# EAGLE design template_attiny_44_soic-14 (EAGLE 9.6.2)
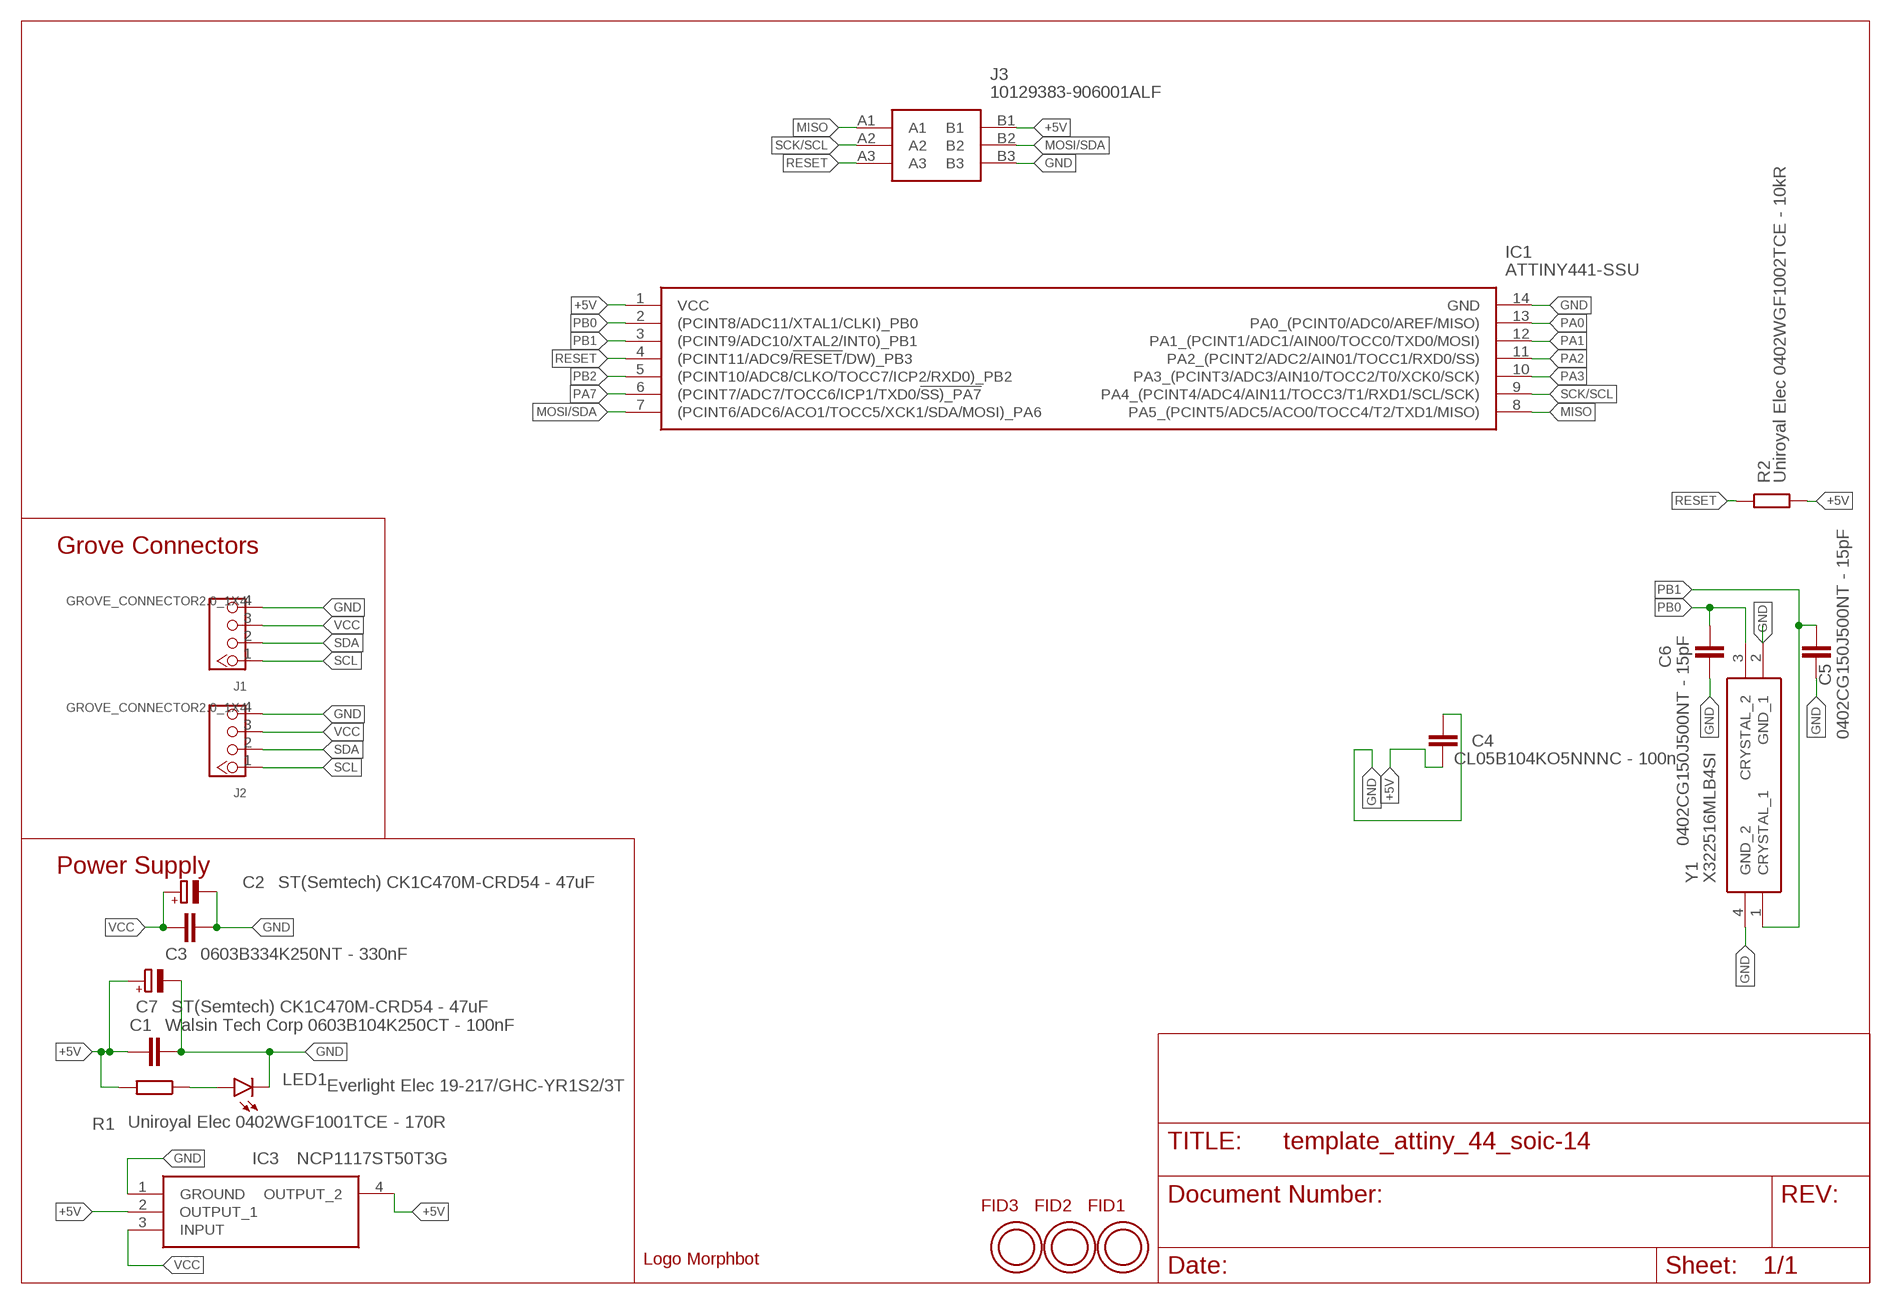
[diagram p0: schematic, sheet 1]

## Parts
C1  Walsin Tech Corp 0603B104K250CT - 100nF  C-EUC0603  [C0603]
C2  ST(Semtech) CK1C470M-CRD54 - 47uF  CPOL-EUC  [PANASONIC_C]
C3  0603B334K250NT - 330nF  C-EUC0603  [C0603]
C4  CL05B104KO5NNNC - 100n  C-EUC0402  [C0402]
C5  0402CG150J500NT - 15pF  C-EUC0402  [C0402]
C6  0402CG150J500NT - 15pF  C-EUC0402  [C0402]
C7  ST(Semtech) CK1C470M-CRD54 - 47uF  CPOL-EUC  [PANASONIC_C]
FID1  OPEN-PNP-FIDUCIAL  [OPEN-PNP-FIDUCIAL]
FID2  OPEN-PNP-FIDUCIAL  [OPEN-PNP-FIDUCIAL]
FID3  OPEN-PNP-FIDUCIAL  [OPEN-PNP-FIDUCIAL]
IC1  ATTINY441-SSU  [SOIC127P600X175-14N]
IC3  NCP1117ST50T3G  [SOT230P700X180-4N]
J1  GROVE_CONNECTOR2.0_1X4  [2.0_1X4_STRAIGHT]
J2  GROVE_CONNECTOR2.0_1X4  [2.0_1X4_STRAIGHT]
J3  10129383-906001ALF  [10129383906001ALF]
LED1  Everlight Elec 19-217/GHC-YR1S2/3T  LEDCHIPLED_0603  [CHIPLED_0603]
R1  Uniroyal Elec 0402WGF1001TCE - 170R  R-EU_R0402  [R0402]
R2  Uniroyal Elec 0402WGF1002TCE - 10kR  R-EU_R0402  [R0402]
U$1  LOGO_MORPHBOT5MM  [LOGO_MORPHBOT]
Y1  X322516MLB4SI  [X322516MLB4SI]

## Nets
+5V: C1.1 C4.1 C7.+ IC1.1(VCC) IC3.2(OUTPUT_1) IC3.4(OUTPUT_2) J3.B1 R1.2 R2.2
GND: C1.2 C2.- C3.1 C4.2 C5.1 C6.1 C7.- IC1.14(GND) IC3.1(GROUND) J1.4 J2.4 J3.B3 LED1.C Y1.2(GND_1) Y1.4(GND_2)
MISO: IC1.8(PA5_(PCINT5/ADC5/ACO0/TOCC4/T2/TXD1/MISO)) J3.A1
MOSI/SDA: IC1.7((PCINT6/ADC6/ACO1/TOCC5/XCK1/SDA/MOSI)_PA6) J3.B2
N$1: LED1.A R1.1
PA0: IC1.13(PA0_(PCINT0/ADC0/AREF/MISO))
PA1: IC1.12(PA1_(PCINT1/ADC1/AIN00/TOCC0/TXD0/MOSI))
PA2: IC1.11(PA2_(PCINT2/ADC2/AIN01/TOCC1/RXD0/SS))
PA3: IC1.10(PA3_(PCINT3/ADC3/AIN10/TOCC2/T0/XCK0/SCK))
PA7: IC1.6((PCINT7/ADC7/TOCC6/ICP1/TXD0/!SS)_PA7)
PB0: C6.2 IC1.2((PCINT8/ADC11/XTAL1/CLKI)_PB0) Y1.3(CRYSTAL_2)
PB1: C5.2 IC1.3((PCINT9/ADC10/XTAL2/INT0)_PB1) Y1.1(CRYSTAL_1)
PB2: IC1.5((PCINT10/ADC8/CLKO/TOCC7/ICP2/RXD0)_PB2)
RESET: IC1.4((PCINT11/ADC9/!RESET!/DW)_PB3) J3.A3 R2.1
SCK/SCL: IC1.9(PA4_(PCINT4/ADC4/AIN11/TOCC3/T1/RXD1/SCL/SCK)) J3.A2
SCL: J1.1 J2.1
SDA: J1.2 J2.2
VCC: C2.+ C3.2 IC3.3(INPUT) J1.3 J2.3

## Notes on the sheet
- Grove Connectors
- Power Supply

## Library data of the parts
C1 C3-C6 = rcl:C-EU: CAPACITOR, European symbol; SPICEPREFIX: C
C2 C7 = rcl:CPOL-EU: POLARIZED CAPACITOR, European symbol; SPICEPREFIX: C
FID1-FID3 = topo-eng:OPEN-PNP-FIDUCIAL
IC1 = samacsys:ATTINY441-SSU: 8-bit Microcontrollers - MCU 16MHz 0.150" 14 SOIC Source: Datasheet <http://docs-emea.rs-online.com/webdocs/1441/0900766b81441b76.pdf>; ARROW_PART_NUMBER: ATTINY441-SSU; ARROW_PRICE-STOCK: https://www.arrow.com/en/products/attiny441-ssu/microchip-technology; DESCRIPTION: 8-bit Microcontrollers - MCU 16MHz 0.150" 14 SOIC; HEIGHT: 1.75mm; MANUFACTURER_NAME: Microchip; MANUFACTURER_PART_NUMBER: ATTINY441-SSU; MOUSER_PART_NUMBER: 556-ATTINY441-SSU; MOUSER_PRICE-STOCK: https://www.mouser.co.uk/ProductDetail/Microchip-Technology-Atmel/ATTINY441-SSU/?qs=HVbQlW5zcXWQGPvGy4LqgA%3D%3D
IC3 = samacsys:NCP1117ST50T3G: ON SEMICONDUCTOR - NCP1117ST50T3G - LDO, REG, 20VIN, 1A, 5V, 1%, SOT223-3 Source: Datasheet <http://www.onsemi.com/pub/Collateral/NCP1117-D.PDF>; ARROW_PART_NUMBER: NCP1117ST50T3G; ARROW_PRICE-STOCK: https://www.arrow.com/en/products/ncp1117st50t3g/on-semiconductor; DESCRIPTION: ON SEMICONDUCTOR - NCP1117ST50T3G - LDO, REG, 20VIN, 1A, 5V, 1%, SOT223-3; HEIGHT: 1.8mm; MANUFACTURER_NAME: ON Semiconductor; MANUFACTURER_PART_NUMBER: NCP1117ST50T3G; MOUSER_PART_NUMBER: 863-NCP1117ST50T3G; MOUSER_PRICE-STOCK: https://www.mouser.co.uk/ProductDetail/ON-Semiconductor/NCP1117ST50T3G?qs=Gev%252BmEvV0ib6dijy6U0dhQ%3D%3D
J1 J2 = morphbot:GROVE_CONNECTOR: Seeedstudio Grove-Connector: 1 = SCL 2 = SDA 3 = VCC 4 = GND
J3 = samacsys:10129383-906001ALF: Headers & Wire Housings ECONOSTIK HEADER DR VT SMT 2X3 Source: Datasheet <https://componentsearchengine.com/Datasheets/1/10129383-906001ALF.pdf>; ARROW_PART_NUMBER: 10129383-906001ALF; ARROW_PRICE-STOCK: https://www.arrow.com/en/products/10129383-906001alf/amphenol-fci; DESCRIPTION: Headers & Wire Housings ECONOSTIK HEADER DR VT SMT 2X3; HEIGHT: 8.58mm; MANUFACTURER_NAME: Amphenol; MANUFACTURER_PART_NUMBER: 10129383-906001ALF; MOUSER_PART_NUMBER: 649-1012938390601ALF; MOUSER_PRICE-STOCK: https://www.mouser.co.uk/ProductDetail/Amphenol-FCI/10129383-906001ALF?qs=0lQeLiL1qyZsINMRDvT9Pw%3D%3D
LED1 = led:LED: LED OSRAM: - CHIPLED LG R971, LG N971, LY N971, LG Q971, LY Q971, LO R971, LY R971 LH N974, LH R974 LS Q976, LO Q976, LY Q976 LO Q996 - Hyper CHIPLED LW Q18S LB Q993, LB Q99A, LB R99A - SideLED LS A670, LO A670, LY A670, LG A670, LP A670 LB A673, LV A673, LT A673, LW A673 LH A674 LY A675 LS A676, LA A676, LO A676, LY A676, LW A676 LS A679, LY A679, LG A679 - Hyper Micro SIDELED® LS Y876, LA Y876, LO Y876, LY Y876 LT Y87S - SmartLED LW L88C, LW L88S LB L89C, LB L89S, LG L890 LS L89K, LO L89K, LY L89K LS L896, LA L896, LO L896, LY L896 - TOPLED LS T670, LO T670, LY T670, LG T670, LP T670 LSG T670, LSP T670, LSY T670, LOP T670, LYG T670 LG T671, LOG T671, LSG T671 LB T673, LV T673, LT T673, LW T673 LH T674 LS T676, LA T676, LO T676, LY T676, LB T676, LH T676, LSB T676, LW T676 LB T67C, LV T67C, LT T67C, LS T67K, LO T67K, LY T67K, LW E67C LS E67B, LA E67B, LO E67B, LY E67B, LB E67C, LV E67C, LT E67C LW T67C LS T679, LY T679, LG T679 LS T770, LO T770, LY T770, LG T770, LP T770 LB T773, LV T773, LT T773, LW T773 LH T774 LS E675, LA E675, LY E675, LS T675 LS T776, LA T776, LO T776, LY T776, LB T776 LHGB T686 LT T68C, LB T68C - Hyper Mini TOPLED® LB M676 - Mini TOPLED Santana® LG M470 LS M47K, LO M47K, LY M47K Source: http://www.osram.convergy.de LUXEON: - LUMILED® LXK2-PW12-R00, LXK2-PW12-S00, LXK2-PW14-U00, LXK2-PW14-V00 LXK2-PM12-R00, LXK2-PM12-S00, LXK2-PM14-U00 LXK2-PE12-Q00, LXK2-PE12-R00, LXK2-PE12-S00, LXK2-PE14-T00, LXK2-PE14-U00 LXK2-PB12-K00, LXK2-PB12-L00, LXK2-PB12-M00, LXK2-PB14-N00, LXK2-PB14-P00, LXK2-PB14-Q00 LXK2-PR12-L00, LXK2-PR12-M00, LXK2-PR14-Q00, LXK2-PR14-R00 LXK2-PD12-Q00, LXK2-PD12-R00, LXK2-PD12-S00 LXK2-PH12-R00, LXK2-PH12-S00 LXK2-PL12-P00, LXK2-PL12-Q00, LXK2-PL12-R00 Source: www.luxeon.com KINGBRIGHT: KA-3528ASYC Source: www.kingbright.com
R1 R2 = rcl:R-EU_: RESISTOR, European symbol; SPICEPREFIX: R
U$1 = topo-eng:LOGO_MORPHBOT
Y1 = samacsys:X322516MLB4SI: Crystal Source: Datasheet <https://datasheet.lcsc.com/szlcsc/Yangxing-Tech-X322516MLB4SI_C13738.pdf>; DESCRIPTION: Crystal; HEIGHT: 0.8mm; MANUFACTURER_NAME: Yangxing Tech; MANUFACTURER_PART_NUMBER: X322516MLB4SI

## Board
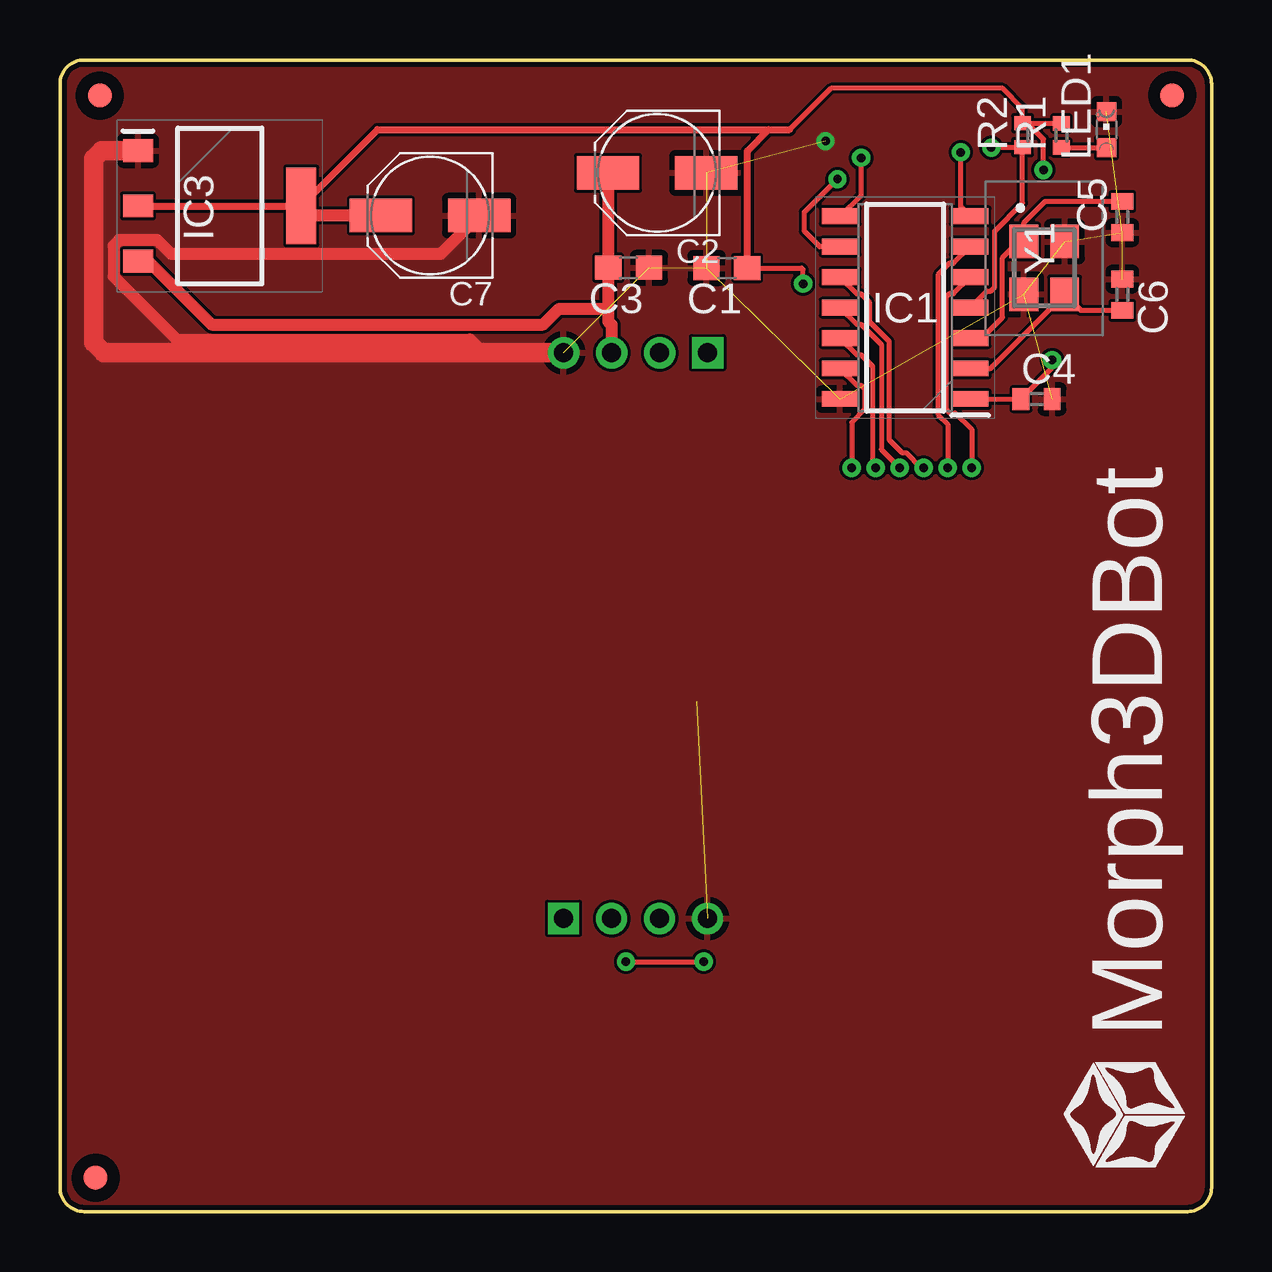
[diagram p1: board, top side]
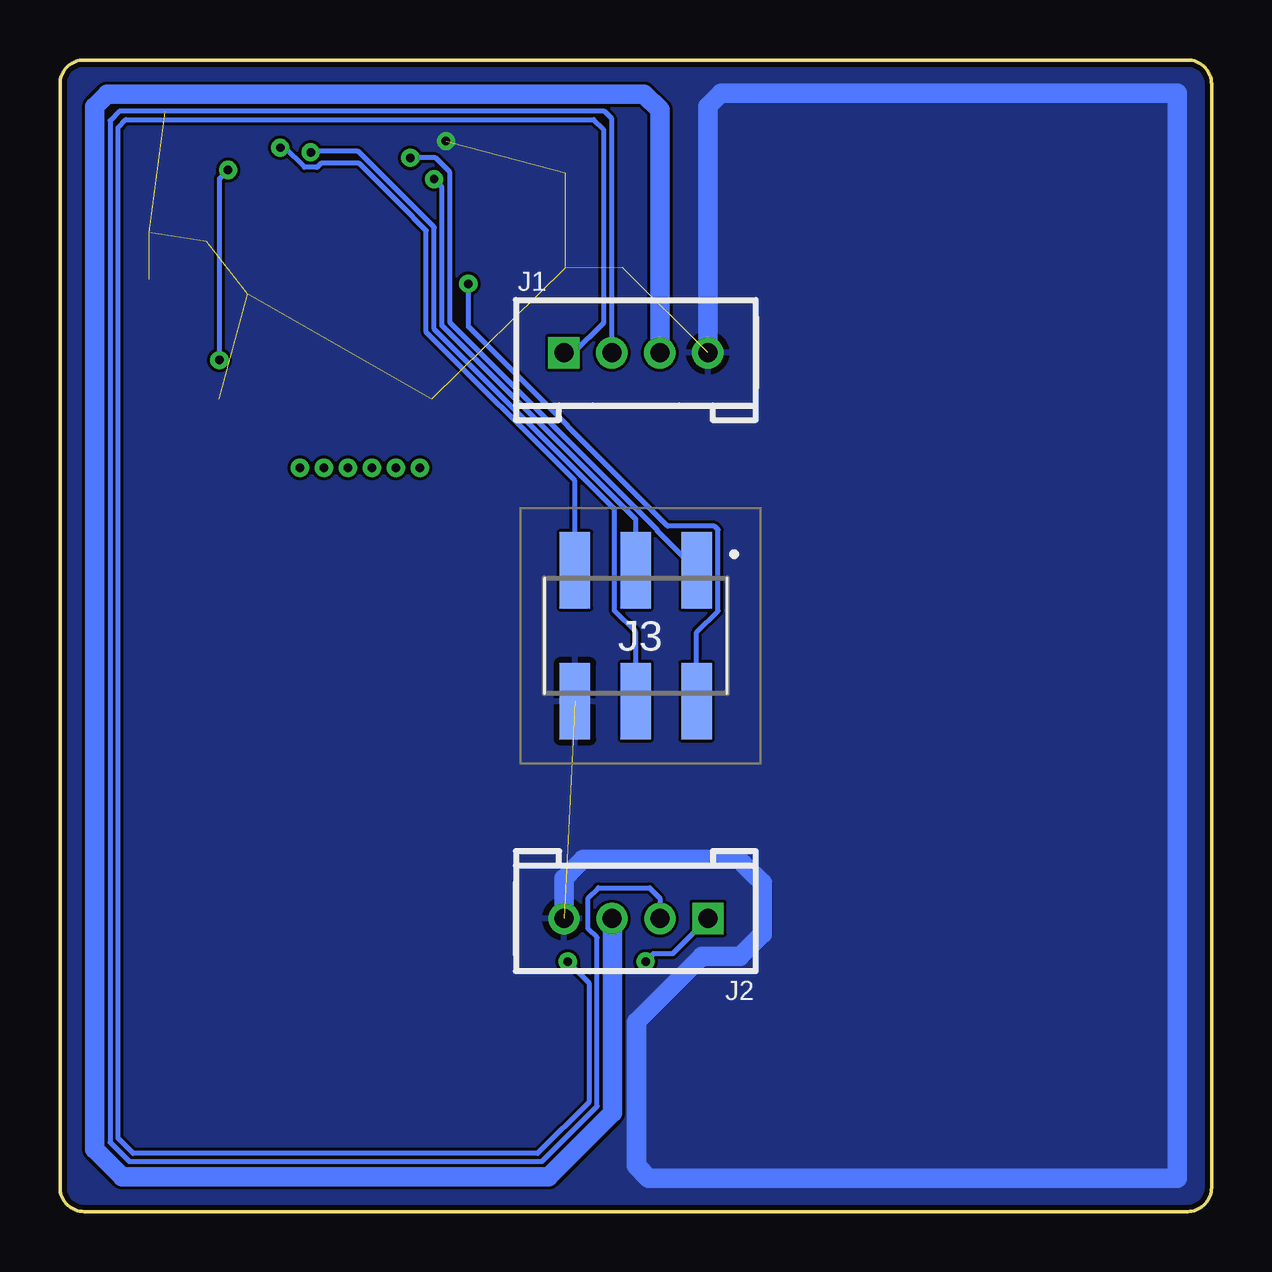
[diagram p2: board, bottom side, seen from below]

Size 48 x 48 mm. Coordinates in mm from the lower left corner, seen from the top.
Outline: 47,0 1,0 arc-90 0,1 0,47 arc-90 1,48 47,48 arc-90 48,47 48,1 arc-90 47,0
Copper layers (1*16): Top 0.035mm / dielectric 0.2mm / Bottom 0.035mm
Design rules "jlcpcb_4_layer *": minimum track width 3.5mil, minimum drill 0.2mm, track to track 5mil, track to pad 6mil, pad to pad 6mil, via to via 6mil, smd to smd 6mil, copper to edge 0.2mm, drill to drill 6mil, minimum pad ring 10mil, minimum via ring 8mil, stop-mask expansion 4mil, vias tented up to drill 0mil, thermal gap 10mil
bKeepout: area 24,0 to 48,48; area 0,0 to 24,48

### Footprints (pad centres in the part's own frame; a part is rotated, then mirrored left to right if it is on the bottom)
C0603 = smd 1.1 x 1: 1 -0.85,0; 2 0.85,0
PANASONIC_C = smd 2.6 x 1.4: + 2.05,0; - -2.05,0
C0402 = smd 0.7 x 0.9: 1 -0.65,0; 2 0.65,0
OPEN-PNP-FIDUCIAL = smd 1 x 1: FID$1 0,0
SOIC127P600X175-14N = smd 1.528 x 0.65: 1 -2.711,3.81; 2 -2.711,2.54; 3 -2.711,1.27; 4 -2.711,0; 5 -2.711,-1.27; 6 -2.711,-2.54; 7 -2.711,-3.81; 8 2.711,-3.81; 9 2.711,-2.54; 10 2.711,-1.27; 11 2.711,0; 12 2.711,1.27; 13 2.711,2.54; 14 2.711,3.81
SOT230P700X180-4N = smd 1.25 x 0.95: 1 -3.4,2.3; 2 -3.4,0; 3 -3.4,-2.3 | smd 1.25 x 3.2: 4 3.4,0
2.0_1X4_STRAIGHT = drill 0.8 pad 1.27 square: 1 1.83,-1.786 | drill 0.8 pad 1.27: 2 3.83,-1.786; 3 5.83,-1.786; 4 7.83,-1.786
10129383906001ALF = smd 1.27 x 3.18: A1 -2.54,-2.73; A2 0,-2.73; A3 2.54,-2.73; B1 -2.54,2.73; B2 0,2.73; B3 2.54,2.73
CHIPLED_0603 = smd 0.8 x 0.8: A 0,-0.75; C 0,0.75
R0402 = smd 0.6 x 0.7: 1 -0.5,0; 2 0.5,0
X322516MLB4SI = smd 1.4 x 1.2: 1 -1.1,-0.85; 2 1.1,-0.85; 3 1.1,0.85; 4 -1.1,0.85

### Placement (x,y rotation side)
C1  27.8,39.33 180 top
C2  24.89,43.29 180 top
C3  23.7,39.34 180 top
C4  40.71,33.86 0 top
C5  44.28,41.45 90 top
C6  44.28,38.22 270 top
C7  15.43,41.52 180 top
FID1  1.48,1.41 0 top
FID2  1.66,46.52 0 top
FID3  46.36,46.53 0 top
IC1  35.23,37.68 180 top
IC3  6.66,41.92 0 top
J1  28.83,37.58 0 bottom
J2  19.16,10.43 180 bottom
J3  24,24 180 bottom
LED1  43.62,45.09 0 top
R1  41.74,44.85 90 top
R2  40.12,44.86 90 top
U$1  47.14,1.29 90 top
Y1  41.03,39.33 270 top

### Tracks (layer width: path | path; a pad name or v marks a point on that pad's centre or on a via)
+5V  (via drill 0.35)
  Top 0.2: 30.41,45.09 32.14,46.82 39.3,46.82 40.12,46 R2.2 40.33,45.37 | C1.1 30.92,39.33 30.98,39.27 v30.98,38.67 | 40.33,45.37 41.73,45.37 R1.2 | v40.99,43.42 40.99,44.7 40.33,45.37 | IC1.1 C4.1 41.35,35.16 v41.35,35.49
  Top 0.3: 29.54,45.09 30.41,45.09 | C1.1 28.65,44.21 29.54,45.09 | IC3.2 9.97,41.91 IC3.4 13.24,45.09 29.54,45.09
  Top 0.5: C7.+ 10.37,41.52 9.97,41.91
  Bottom 0.2: J3.B1 21.46,24.15 20.57,25.04 20.57,28.43 20.72,28.57 22.67,28.57 30.98,36.88 v30.98,38.67 | v41.35,35.49 41.35,43.05 v40.99,43.42
GND  (via drill 0.35)  (12 unrouted)
  Top 0.5: 17.63,35.8 17.09,36.34 4.86,36.34 2.23,38.97 2.23,40.26 2.46,40.49 4.05,40.49 4.63,39.91 15.87,39.91 C7.-
  Top 0.813: IC3.1 1.74,44.22 1.41,43.88 1.41,36.22 1.83,35.8 17.63,35.8 J1.4
  Bottom 0.813: J1.4 21,46.07 20.45,46.61 1.42,46.61 1.42,1.39 23.46,1.39 23.98,1.9 23.98,7.9 21.23,10.64 19.65,10.64 18.72,11.57 18.72,13.7 19.7,14.68 26.2,14.68 26.99,13.89 J2.4
  other vias: 31.91,44.62
  pour Bottom: 1,0 arc-90 0,1 0,47 arc-90 1,48 47,48 arc-90 48,47 48,1 arc-90 47,0
  pour Top: 1,0 arc-90 0,1 0,47 arc-90 1,48 47,48 arc-90 48,47 48,1 arc-90 47,0
MISO  (via drill 0.35)
  Top 0.2: IC1.8 33.4,42.37 v33.4,43.92
  Bottom 0.2: J3.A1 23.11,28.38 23.11,28.43 31.75,37.06 31.75,43.32 32.35,43.92 v33.4,43.92
MOSI/SDA  (via drill 0.35)
  Top 0.2: IC1.7 37.55,41.88 v37.55,44.15
  Bottom 0.2: v37.55,44.15 37.55,44.19 35.56,44.19 32.4,41.03 32.4,36.79 24.89,29.27 24.89,25.04 24,24.15 J3.B2
N$1
  Top 0.2: R1.1 43.61,44.35 LED1.A
PA0  (via drill 0.35)
  Top 0.2: v33,31 33,32.9 33.53,33.44 33.53,34.3 33.39,34.45 33.21,34.45 IC1.13
PA1  (via drill 0.35)
  Top 0.2: IC1.12 33.21,35.72 33.39,35.72 33.87,35.23 33.87,31.13 v34,31
PA2  (via drill 0.35)
  Top 0.2: IC1.11 33.21,36.98 33.39,36.98 34.23,36.14 34.23,31.77 v35,31
PA3  (via drill 0.35)
  Top 0.2: IC1.10 33.21,38.26 33.39,38.26 33.74,37.9 33.74,37.1 34.56,36.28 34.56,32.17 35.1,31.63 35.26,31.63 35.89,31 v36,31
PA7  (via drill 0.35)
  Top 0.2: IC1.6 37.25,39.52 37.07,39.52 36.6,39.05 36.6,33.23 37,32.82 v37,31
PB0
  Top 0.2: C6.2 42.54,37.57 Y1.3 38.78,35.14 IC1.2
PB1
  Top 0.2: C5.2 41.07,42.1 40.18,41.21 Y1.1 40.17,40.44 39.97,40.44 39.29,39.76 39.29,37.26 38.43,36.41 IC1.3
PB2  (via drill 0.35)
  Top 0.2: IC1.5 37.25,38.26 37.07,38.26 36.92,38.11 36.92,33.44 37.07,33.29 37.32,33.29 38,32.61 v38,31
RESET  (via drill 0.35)
  Top 0.2: v38.82,44.34 40.1,44.34 R2.1 40.12,42.03 38.96,40.87 38.96,38.52 38.81,38.37 38.63,38.37 IC1.4
  Bottom 0.2: J3.A3 26.54,30.46 32.73,36.66 32.73,40.89 33.81,41.97 35.53,43.69 37.12,43.69 37.29,43.52 37.81,43.52 38.63,44.34 v38.82,44.34
SCK/SCL  (via drill 0.35)
  Top 0.2: IC1.9 31.68,40.22 31.03,40.87 31.03,41.66 v32.41,43.04
  Bottom 0.2: J3.A2 24,28.85 32.08,36.93 32.08,42.71 v32.41,43.04
SCL  (via drill 0.35)
  Top 0.2: v23.59,10.41 v26.83,10.41
  Bottom 0.2: J2.1 22.46,10.74 23.26,10.74 v23.59,10.41 | v26.83,10.41 25.96,9.54 25.96,4.55 28.08,2.42 44.96,2.42 45.58,3.04 45.58,45.19 45.25,45.51 25.76,45.51 25.35,45.11 25.35,37.04 26.59,35.8 J1.1
SDA
  Bottom 0.2: J1.2 25,45.54 25.31,45.86 45.53,45.86 45.91,45.48 45.91,2.88 45.12,2.09 27.92,2.09 25.61,4.39 25.61,11.42 25.98,11.79 25.98,13.07 25.55,13.49 23.43,13.49 22.99,13.06 J2.2
VCC
  Top 0.5: J1.3 23,36.95 22.85,37.1 22.85,37.63 | 22.85,37.63 C3.2 C2.+ | IC3.3 3.67,39.62 6.32,36.97 20.15,36.97 20.81,37.63 22.85,37.63
  Bottom 0.5: 24.97,12.2 J2.3
  Bottom 0.813: J1.3 23,45.92 23.65,46.57 46.02,46.57 46.55,46.05 46.55,2.59 45.4,1.45 27.64,1.45 24.97,4.12 24.97,12.2